# EasyEDA schematic CPM- Circuital Printing Machine_2020-06-25_01-42-40.json
TITLE: Sheet_1; REV: 1.0; Date: 2020-06-24; Sheet: 1/1; Drawn By: GuilhermeA; Company: Your Company
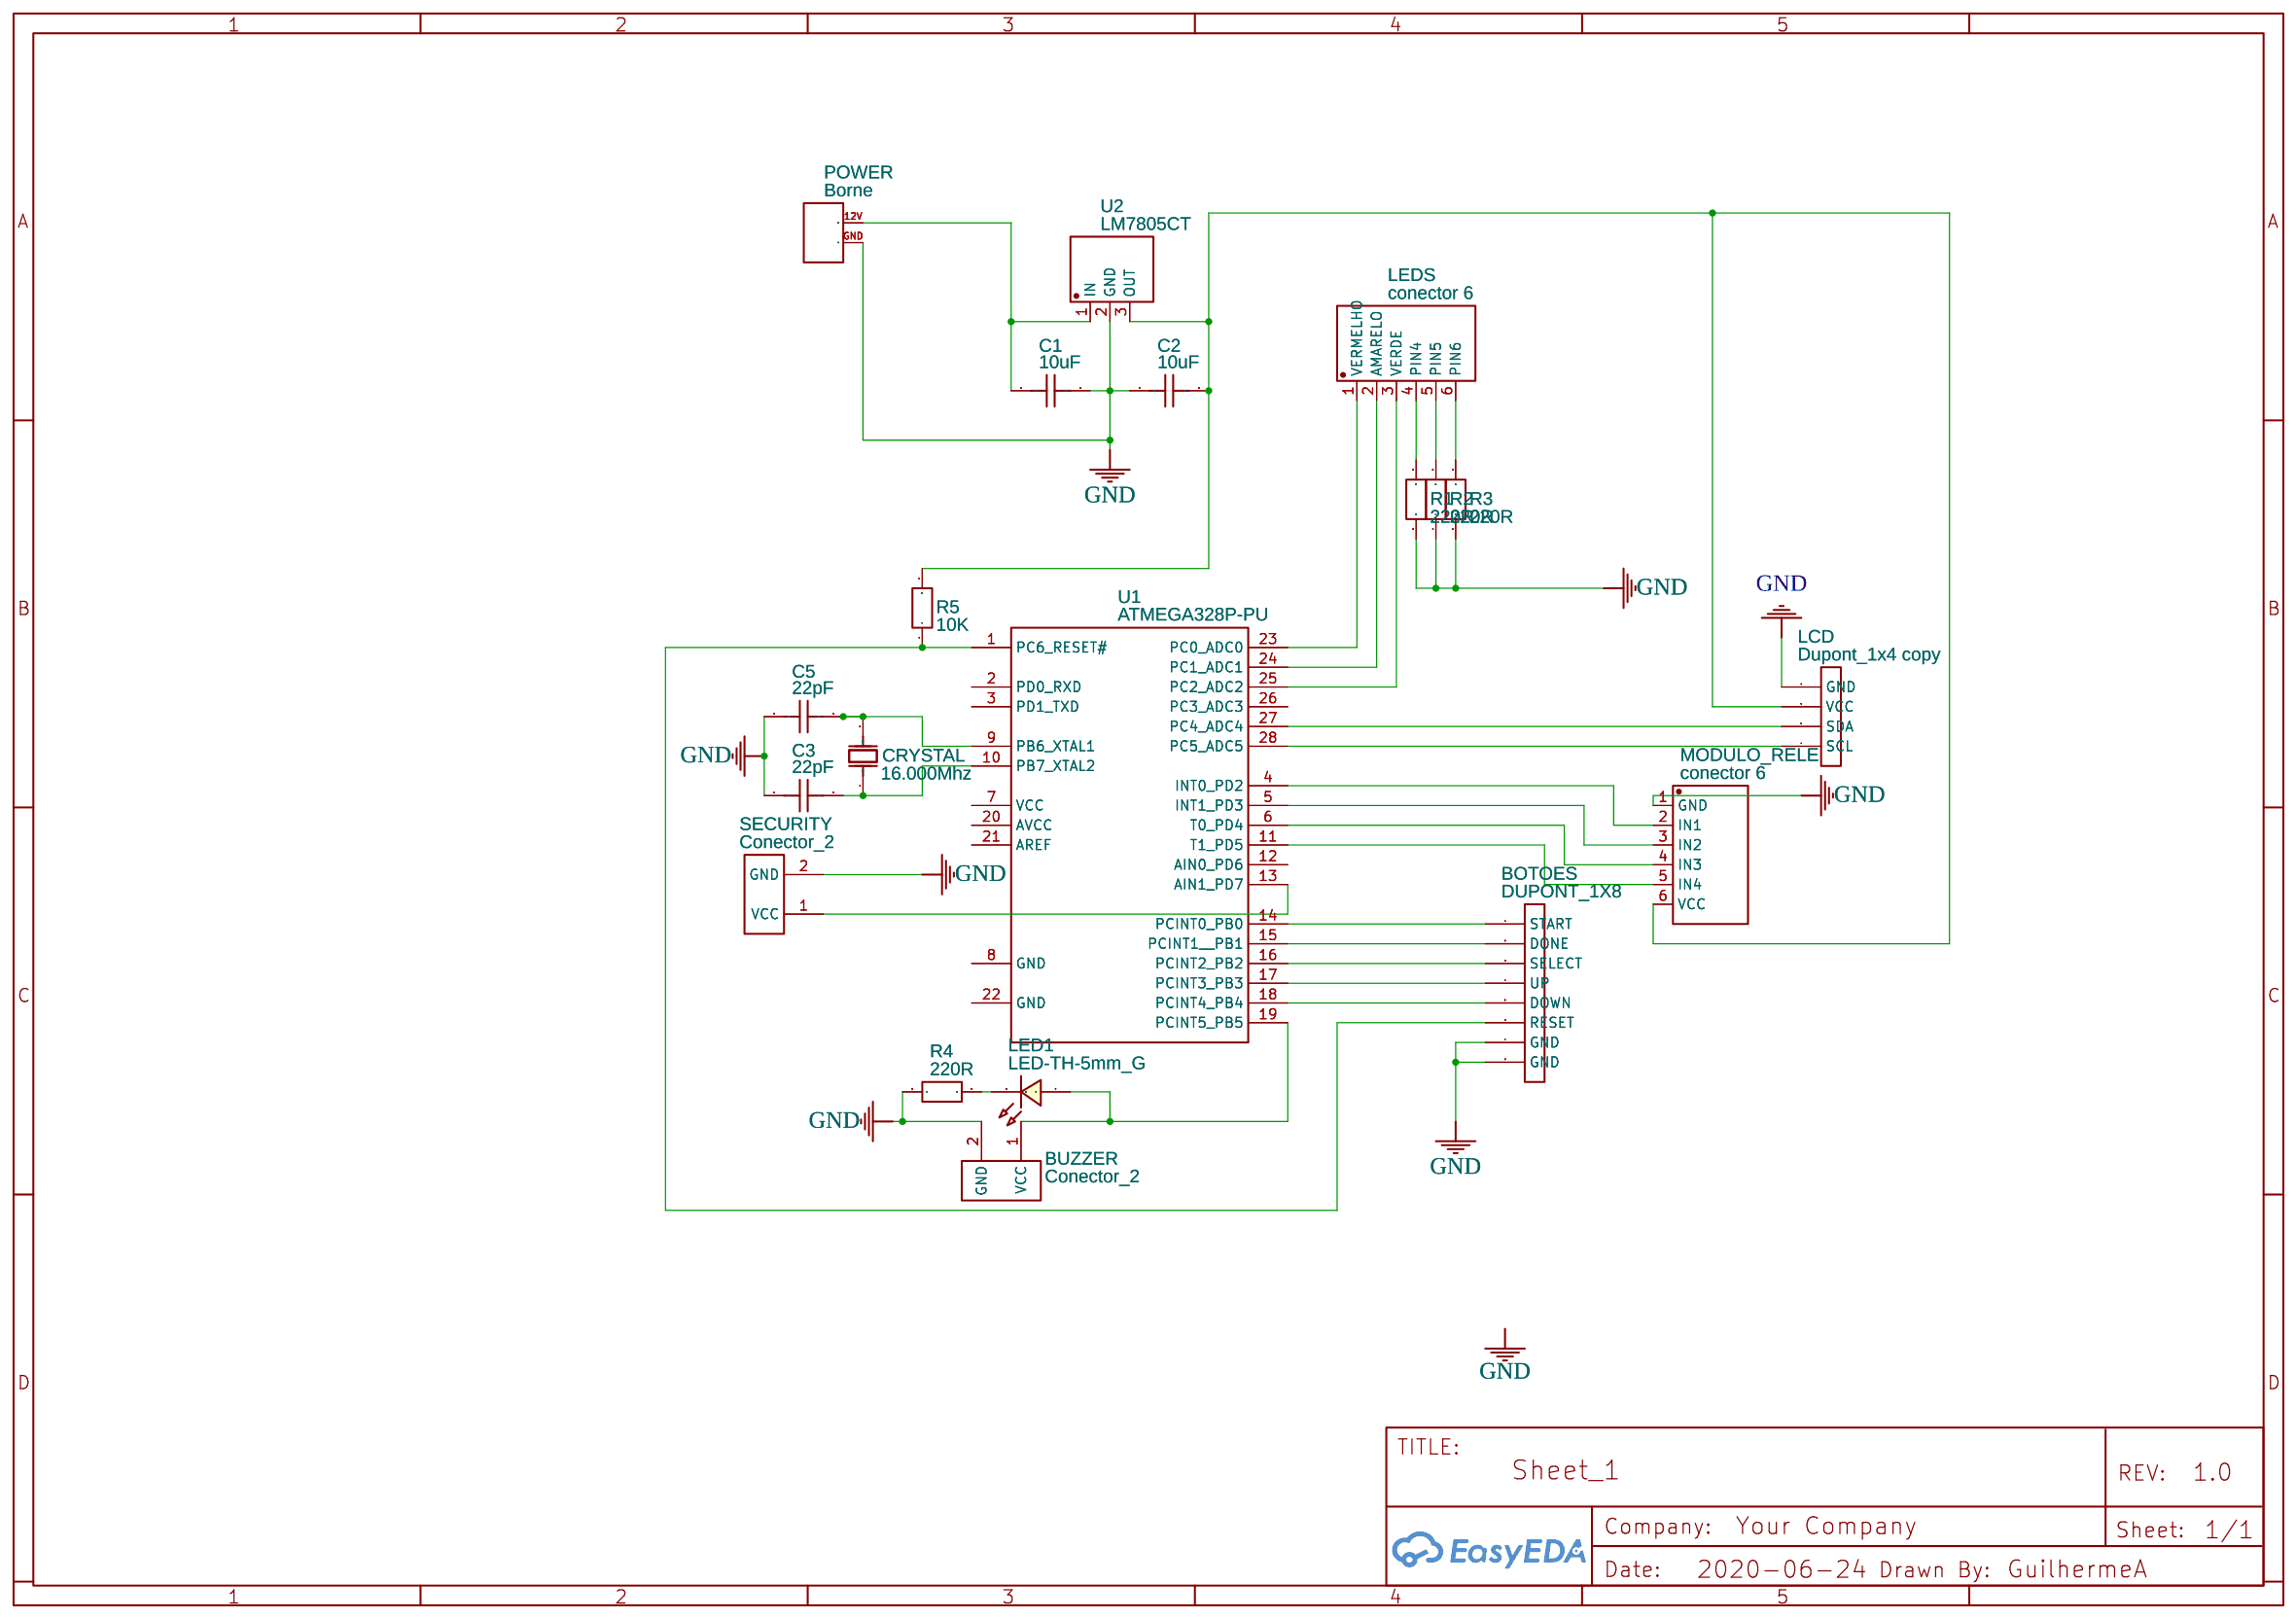
[diagram p0: schematic sheet]

## Parts
BOTOES  DUPONT_1X8  [DUPONT_1X8]
BUZZER  Conector_2  [CONECTOR2]
C1  10uF  [RAD-0.1]
C2  10uF  [RAD-0.1]
C3  22pF  [RAD-0.1]
C5  22pF  [RAD-0.1]
CRYSTAL  16.000Mhz  [HC-49S_L11.0-W4.4-P4.88]
LCD  Dupont_1x4 copy  [DUPONT_1X4]
LED1  LED-TH-5mm_G  [LED-TH_BD5.0_GREEN]
LEDS  conector 6  [CONNECTOR7P]
MODULO_RELE  conector 6  [CONNECTOR7P]
POWER  Borne  [BORNES 1X2]
R1  220R  [R_AXIAL-0.3]
R2  220R  [R_AXIAL-0.3]
R3  220R  [R_AXIAL-0.3]
R4  220R  [R_AXIAL-0.3]
R5  10K  [R_AXIAL-0.3]
SECURITY  Conector_2  [CONECTOR2]
U1  ATMEGA328P-PU  [DIP-28_L34.6-W7.3-P2.54-LS10.2-BL]
U2  LM7805CT  [TO-220-3_L10.0-W4.5-P2.54-L]

## Library data of the parts
BOTOES = DUPONT_1X8: Manufacturer Part: Conector_dupont; Contributor: invenitec
BUZZER SECURITY = Conector_2: Manufacturer Part: Conector2; Contributor: CARVAJAL QUINTANA NICOLAS
C1-C3 C5 = C_RAD-0.1_US: Contributor: LCEDA_Lib
CRYSTAL = 5S0-2700A2020-00: Supplier: LCSC; Supplier Part: C389767; Manufacturer: XTY; Contributor: LCSC
LCD = Dupont_1x4 copy: Manufacturer Part: Conector_dupont; Contributor: invenitec
LED1 = LED-TH-5mm_G: Manufacturer: EVERLIGHT(台湾亿光); Manufacturer Part: 333-2SYGD/S530-E2; Supplier Part: C88163; Supplier: LCSC; Contributor: LCEDA_Lib
LEDS MODULO_RELE = conector 6: Supplier Part: C89538; Supplier: LCSC; Manufacturer: SUPU; Manufacturer Part: 425Connectors- -07P-2.5mmWhite Grey; Contributor: inge_123
POWER = Borne: Contributor: Kyros Engenharia
R1-R5 = R_AXIAL-0.3_EU: Contributor: LCEDA_Lib
U1 = ATMEGA328P-PU: sourceId: Oic6oiASL; Supplier: LCSC; Manufacturer: MICROCHIP; image: //image.lceda.cn/szlcsc/C33901.jpg; Contributor: LCSC; Supplier Part: C33901
U2 = LM7805CT: Supplier: LCSC; Manufacturer: FAIRCHILD; image: //image.lceda.cn/szlcsc/C22146.jpg; Supplier Part: C22146

## Nets
GND: BOTOES.7(GND) BOTOES.8(GND) BUZZER.2(GND) C1.2 C2.1 C3.1 C5.1 LCD.1(GND) MODULO_RELE.1(GND) POWER.GND(1) R1.1 R2.1 R3.1 R4.2 SECURITY.2(GND) U2.2(GND)
Net-(BOTOES-1): BOTOES.1(START) U1.14(PCINT0 PB0)
Net-(BOTOES-2): BOTOES.2(DONE) U1.15(PCINT1  PB1)
Net-(BOTOES-3): BOTOES.3(SELECT) U1.16(PCINT2 PB2)
Net-(BOTOES-4): BOTOES.4(UP) U1.17(PCINT3 PB3)
Net-(BOTOES-5): BOTOES.5(DOWN) U1.18(PCINT4 PB4)
Net-(BOTOES-6): BOTOES.6(RESET) R5.1 U1.1(PC6 RESET#)
Net-(BUZZER-1): BUZZER.1(VCC) LED1.1 U1.19(PCINT5 PB5)
Net-(C1-1): C1.1 POWER.12V(2) U2.1(IN)
Net-(C2-2): C2.2 LCD.2(VCC) MODULO_RELE.6(VCC) R5.2 U2.3(OUT)
Net-(C3-2): C3.2 CRYSTAL.1(OSC1) U1.10(PB7 XTAL2)
Net-(C5-2): C5.2 CRYSTAL.2(OSC2) U1.9(PB6 XTAL1)
Net-(LCD-3): LCD.3(SDA) U1.27(PC4 ADC4)
Net-(LCD-4): LCD.4(SCL) U1.28(PC5 ADC5)
Net-(LED1-2): LED1.2 R4.1
Net-(LEDS-1): LEDS.1(VERMELHO) U1.23(PC0 ADC0)
Net-(LEDS-2): LEDS.2(AMARELO) U1.24(PC1 ADC1)
Net-(LEDS-3): LEDS.3(VERDE) U1.25(PC2 ADC2)
Net-(LEDS-4): LEDS.4(PIN4) R1.2
Net-(LEDS-5): LEDS.5(PIN5) R2.2
Net-(LEDS-6): LEDS.6(PIN6) R3.2
Net-(MODULO_RELE-2): MODULO_RELE.2(IN1) U1.4(INT0 PD2)
Net-(MODULO_RELE-3): MODULO_RELE.3(IN2) U1.5(INT1 PD3)
Net-(MODULO_RELE-4): MODULO_RELE.4(IN3) U1.6(T0 PD4)
Net-(MODULO_RELE-5): MODULO_RELE.5(IN4) U1.11(T1 PD5)
Net-(SECURITY-1): SECURITY.1(VCC) U1.13(AIN1 PD7)

Not connected (* = marked no-connect by the designer): U1 2(PD0 RXD) 3(PD1 TXD) 7(VCC) 8(GND) 12(AIN0 PD6) 20(AVCC) 21(AREF) 22(GND) 26(PC3 ADC3)
